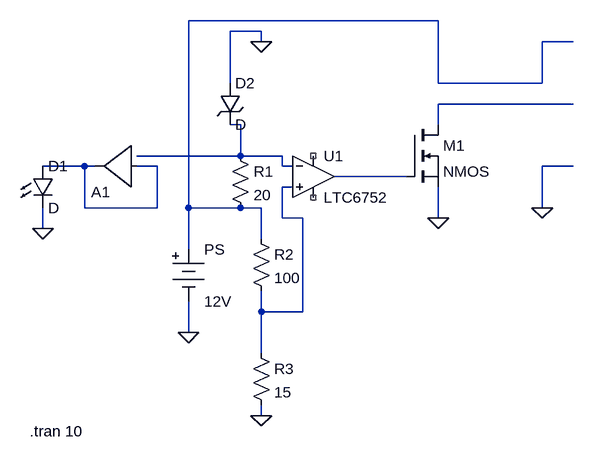
[diagram p0: schematic Model1.asc]
Model1.asc, the LTspice schematic file:
Version 4
SHEET 1 920 680
WIRE 528 -128 144 -128
WIRE 256 -112 208 -112
WIRE 256 -96 256 -112
WIRE 736 -96 688 -96
WIRE 208 -32 208 -112
WIRE 528 -32 528 -128
WIRE 688 -32 688 -96
WIRE 688 -32 528 -32
WIRE 736 0 528 0
WIRE 224 32 208 32
WIRE 528 32 528 0
WIRE 224 80 224 32
WIRE 224 80 64 80
WIRE 288 80 224 80
WIRE -16 96 -80 96
WIRE 0 96 -16 96
WIRE 96 96 64 96
WIRE 288 96 288 80
WIRE 304 96 288 96
WIRE 736 96 688 96
WIRE 480 112 368 112
WIRE 304 128 288 128
WIRE -16 160 -16 96
WIRE 96 160 96 96
WIRE 96 160 -16 160
WIRE 144 160 144 -128
WIRE 224 160 144 160
WIRE 256 160 224 160
WIRE 688 160 688 96
WIRE 288 176 288 128
WIRE 320 176 288 176
WIRE 528 176 528 128
WIRE -80 192 -80 160
WIRE 256 208 256 160
WIRE 144 224 144 160
WIRE 256 320 256 288
WIRE 320 320 320 176
WIRE 320 320 256 320
WIRE 144 352 144 304
WIRE 256 384 256 320
WIRE 256 480 256 464
FLAG -80 192 0
FLAG 528 176 0
FLAG 256 -96 0
FLAG 256 480 0
FLAG 144 352 0
FLAG 688 160 0
SYMBOL Digital\\buf1 64 160 R180
SYMATTR InstName A1
SYMBOL Comparators\\LTC6752 336 48 R0
SYMATTR InstName U1
SYMBOL nmos 480 32 R0
SYMATTR InstName M1
SYMBOL LED -96 96 R0
SYMATTR InstName D1
SYMBOL zener 192 -32 R0
SYMATTR InstName D2
SYMBOL res 208 64 R0
SYMATTR InstName R1
SYMATTR Value 20
SYMBOL res 240 192 R0
SYMATTR InstName R2
SYMATTR Value 100
SYMBOL res 240 368 R0
SYMATTR InstName R3
SYMATTR Value 15
SYMBOL Misc\\battery 144 208 R0
WINDOW 123 0 0 Left 0
WINDOW 39 0 0 Left 0
SYMATTR InstName PS
SYMATTR Value 12V
TEXT -100 504 Left 2 !.tran 10

The netlist it stands for:
* Model1.asc
A1 N004 N003 N003 N003 N003 N003 N004 N003 BUF
XU1 N006 N003 NC_01 NC_02 N005 LTC6752  ; pins In+ In- V+ V- OUT
M1 N002 N005 0 0 NMOS
D1 N004 0 D
D2 0 N003 D
R1 N003 N001 20
R2 N001 N006 100
R3 N006 0 15
V§PS N001 0 12V
.model D D
.lib standard.dio
.model NMOS NMOS
.model PMOS PMOS
.lib standard.mos
.tran 10
.lib LTC7.lib
.backanno
.end